# Altium project Receiver_board.PrjPcb
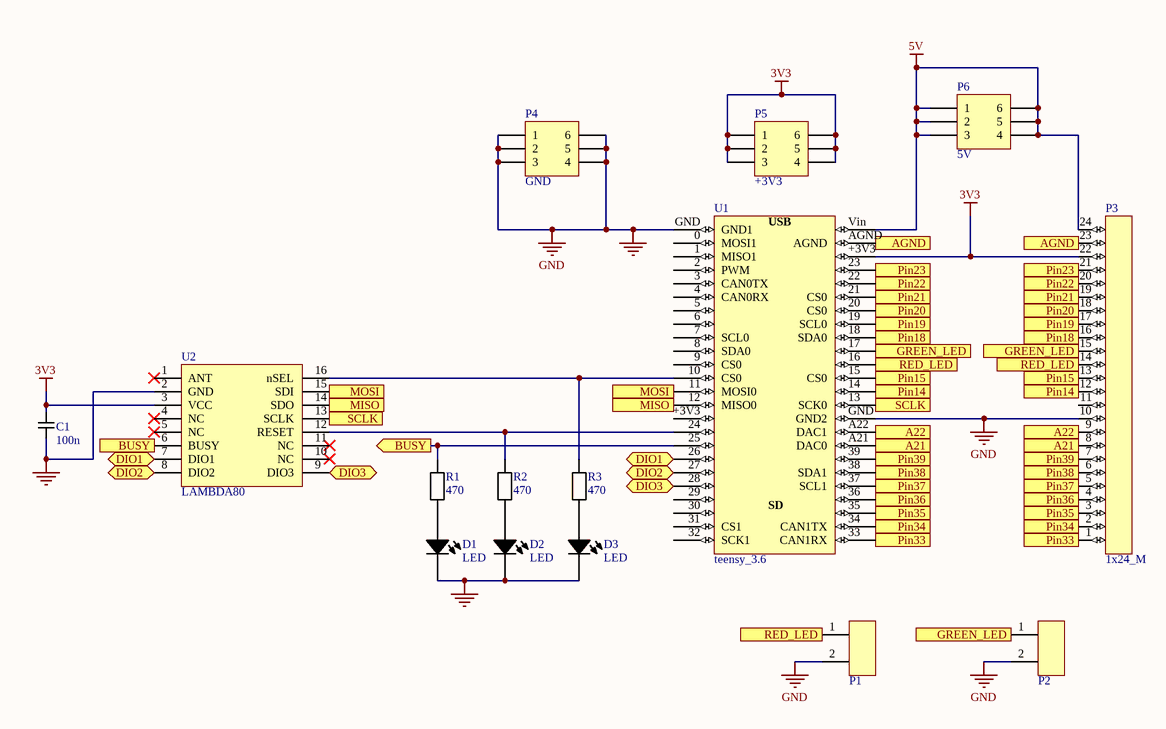
[diagram p0: ReceiverPCB.SchDoc]
1 sheet, 15 parts. Net scope: flat (ports and power ports of the same name join across sheets).
Board file: ReceiverPCB.PcbDoc

## Sheet ReceiverPCB.SchDoc
size A4

### Parts
C1  value 100n  [C_SMD_0805_pcb]  (hidden comment: SMD)
D1  LED  [D_LED_0805]
D2  LED  [D_LED_0805]
D3  LED  [D_LED_0805]
P1  Red_LED  [JST_SE_2PIN]  (value not drawn)
P2  Green_LED  [JST_SE_2PIN]  (value not drawn)
P3  1x24_M  [PIN_HEADER_M_1x24]
P4  GND  [PIN_HEADER_M_2x3]
P5  +3V3  [PIN_HEADER_M_2x3]
P6  5V  [PIN_HEADER_M_2x3]
R1  value 470  [R_SMD_0805_pcb]  (hidden comment: SMD)
R2  value 470  [R_SMD_0805_pcb]  (hidden comment: SMD)
R3  value 470  [R_SMD_0805_pcb]  (hidden comment: SMD)
U1  teensy_3.6  [teensy_3.6]
U2  LAMBDA80  [LAMBDA62_SMT]

### Ports
A21, A22, AGND, BUSY (in), BUSY (out), DIO1 (bidir), DIO2 (bidir), DIO3 (bidir), GREEN_LED, MISO (in), MISO (out), MOSI (in), MOSI (out), Pin14, Pin15, Pin18, Pin19, Pin20, Pin21, Pin22, Pin23, Pin33, Pin34, Pin35, Pin36, Pin37, Pin38, Pin39, RED_LED, SCLK (in), SCLK (out)

### Nets
3V3: C1.1 P3.22 P5.1 P5.2 P5.3 P5.4 P5.5 P5.6 U1.+3V3 U2.3(VCC)
5V: P3.24 P6.1 P6.2 P6.3 P6.4 P6.5 P6.6 U1.Vin
GND: C1.2 D1.2 D2.2 D3.2 P1.2 P2.2 P3.10 P4.1 P4.2 P4.3 P4.4 P4.5 P4.6 U1.GND(GND1) U2.2(GND)
NetD1_1: D1.1 R1.1
NetD2_1: D2.1 R2.1
NetD3_1: D3.1 R3.1
NetP1_1: P1.1 P3.14 U1.16 ; port RED_LED
NetP2_1: P2.1 P3.15 U1.17 ; port GREEN_LED
NetP3_1: P3.1 U1.33(CAN1RX) ; port Pin33
NetP3_2: P3.2 U1.34(CAN1TX) ; port Pin34
NetP3_3: P3.3 U1.35 ; port Pin35
NetP3_4: P3.4 U1.36 ; port Pin36
NetP3_5: P3.5 U1.37(SCL1) ; port Pin37
NetP3_6: P3.6 U1.38(SDA1) ; port Pin38
NetP3_7: P3.7 U1.39 ; port Pin39
NetP3_8: P3.8 U1.A21(DAC0) ; port A21
NetP3_9: P3.9 U1.A22(DAC1) ; port A22
NetP3_12: P3.12 U1.14 ; port Pin14
NetP3_13: P3.13 U1.15(CS0) ; port Pin15
NetP3_16: P3.16 U1.18(SDA0) ; port Pin18
NetP3_17: P3.17 U1.19(SCL0) ; port Pin19
NetP3_18: P3.18 U1.20(CS0) ; port Pin20
NetP3_19: P3.19 U1.21(CS0) ; port Pin21
NetP3_20: P3.20 U1.22 ; port Pin22
NetP3_21: P3.21 U1.23 ; port Pin23
NetP3_23: P3.23 U1.AGND ; port AGND
NetR1_2: R1.2 U1.25 U2.6(BUSY) ; port BUSY
NetR2_2: R2.2 U1.24 U2.12(RESET)
NetR3_2: R3.2 U1.10(CS0) U2.16(nSEL)
NetU1_11: U1.11(MOSI0) U2.15(SDI) ; port MOSI
NetU1_12: U1.12(MISO0) U2.14(SDO) ; port MISO
NetU1_13: U1.13(SCK0) U2.13(SCLK) ; port SCLK
NetU1_26: U1.26 U2.7(DIO1) ; port DIO1
NetU1_27: U1.27 U2.8(DIO2) ; port DIO2
NetU1_28: U1.28 U2.9(DIO3) ; port DIO3

Not connected (* = marked no-connect by the designer): P3 11; U1 0(MOSI1) 1(MISO1) 2(PWM) 3(CAN0TX) 4(CAN0RX) 5 6 7(SCL0) 8(SDA0) 9(CS0) 29 30 31(CS1) 32(SCK1); U2 1(ANT)* 4(NC)* 5(NC)* 10(NC)* 11(NC)*

### Notes on the sheet
- (in symbol teensy_3.6) USB; SD

### Library data of the parts
C1 = C_SMD_0805: Supplier 1: *; Supplier Part Number 1: *
D1-D3 = D_LED_0805_SMD
P1 P2 = JST_SE_2PIN: Supplier 1: *; Supplier Part Number 1: *
P3 = PIN_HEADER_M_1x24: Supplier Part Number 1: *; Supplier 1: *
P4-P6 = PIN_HEADER_M_2x3: Supplier 1: *; Supplier Part Number 1: *
R1-R3 = R_SMD_0805: Supplier 1: *; Supplier Part Number 1: *
U2 = LAMBDA_80_DIP
U1 = teensy_3.6: Supplier 1: *; Supplier Part Number 1: *